# EAGLE schematic untitled (EAGLE 7.5.0)
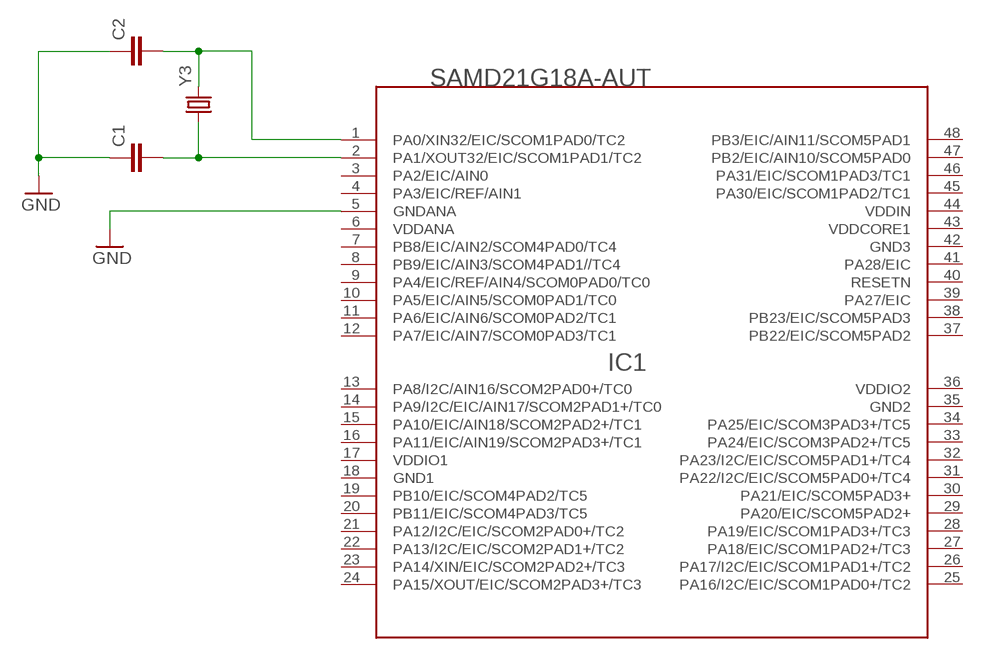
[diagram p0: schematic, sheet 1]

## Parts
C1  C-EUC0603  [C0603]
C2  C-EUC0603  [C0603]
IC1  SAMD21G18A-AUT  1792_SAMD21G18A-AUT  [TQFP48-7X7]
Y3  CRYSTALTXC-7A  [CRYSTAL-TXC-7A]

## Nets
GND: C1.1 C2.1 IC1.5(GNDANA)
N$1: C1.2 IC1.2(PA1/XOUT32/EIC/SCOM1PAD1/TC2) Y3.P$1
N$2: C2.2 IC1.1(PA0/XIN32/EIC/SCOM1PAD0/TC2) Y3.P$2
Unconnected: IC1.3(PA2/EIC/AIN0) IC1.4(PA3/EIC/REF/AIN1) IC1.7(PB8/EIC/AIN2/SCOM4PAD0/TC4) IC1.8(PB9/EIC/AIN3/SCOM4PAD1//TC4) IC1.9(PA4/EIC/REF/AIN4/SCOM0PAD0/TC0) IC1.10(PA5/EIC/AIN5/SCOM0PAD1/TC0) IC1.11(PA6/EIC/AIN6/SCOM0PAD2/TC1) IC1.12(PA7/EIC/AIN7/SCOM0PAD3/TC1) IC1.13(PA8/I2C/AIN16/SCOM2PAD0+/TC0) IC1.14(PA9/I2C/EIC/AIN17/SCOM2PAD1+/TC0) IC1.15(PA10/EIC/AIN18/SCOM2PAD2+/TC1) IC1.16(PA11/EIC/AIN19/SCOM2PAD3+/TC1) IC1.19(PB10/EIC/SCOM4PAD2/TC5) IC1.20(PB11/EIC/SCOM4PAD3/TC5) IC1.21(PA12/I2C/EIC/SCOM2PAD0+/TC2) IC1.22(PA13/I2C/EIC/SCOM2PAD1+/TC2) IC1.23(PA14/XIN/EIC/SCOM2PAD2+/TC3) IC1.24(PA15/XOUT/EIC/SCOM2PAD3+/TC3) IC1.25(PA16/I2C/EIC/SCOM1PAD0+/TC2) IC1.26(PA17/I2C/EIC/SCOM1PAD1+/TC2) IC1.27(PA18/EIC/SCOM1PAD2+/TC3) IC1.28(PA19/EIC/SCOM1PAD3+/TC3) IC1.29(PA20/EIC/SCOM5PAD2+) IC1.30(PA21/EIC/SCOM5PAD3+) IC1.31(PA22/I2C/EIC/SCOM5PAD0+/TC4) IC1.32(PA23/I2C/EIC/SCOM5PAD1+/TC4) IC1.33(PA24/EIC/SCOM3PAD2+/TC5) IC1.34(PA25/EIC/SCOM3PAD3+/TC5) IC1.37(PB22/EIC/SCOM5PAD2) IC1.38(PB23/EIC/SCOM5PAD3) IC1.39(PA27/EIC) IC1.40(RESETN) IC1.41(PA28/EIC) IC1.43(VDDCORE1) IC1.45(PA30/EIC/SCOM1PAD2/TC1) IC1.46(PA31/EIC/SCOM1PAD3/TC1) IC1.47(PB2/EIC/AIN10/SCOM5PAD0) IC1.48(PB3/EIC/AIN11/SCOM5PAD1)

## Power pins joined to a net without a drawn wire
GND1: IC1.18(GND1)
GND2: IC1.35(GND2)
GND3: IC1.42(GND3)
VDDANA: IC1.6(VDDANA)
VDDIN: IC1.44(VDDIN)
VDDIO1: IC1.17(VDDIO1)
VDDIO2: IC1.36(VDDIO2)

## Library data of the parts
C1 C2 = KarlVaello-Capacitors:C-EU: CAPACITOR, European symbol
IC1 = KarlVaello-DigitalIC:1792_SAMD21G18A-AUT: Atmel D21 32bit ARM Cortex-M0 microcontroller - 48 PIN TQFP 256KB flash memory + 32KB SRAM
Y3 = SparkFun-FreqCtrl:CRYSTAL: Various standard crystals. Proven footprints.